# Altium schematic sheet 3DSensor, Magnet.SchDoc
size Letter; Organization: Cegep Limoilou; Address1: 1300, 8e Avenue; Address2: Québec, QC; Address3: Canada; Address4: G1J 5L5; Revision: Enseignants; SheetNumber: 4; SheetTotal: 8; Conception: Ilyes Gharmoul; Titre: 3D sensor and Magnet sensor; Modification: Ilyes G
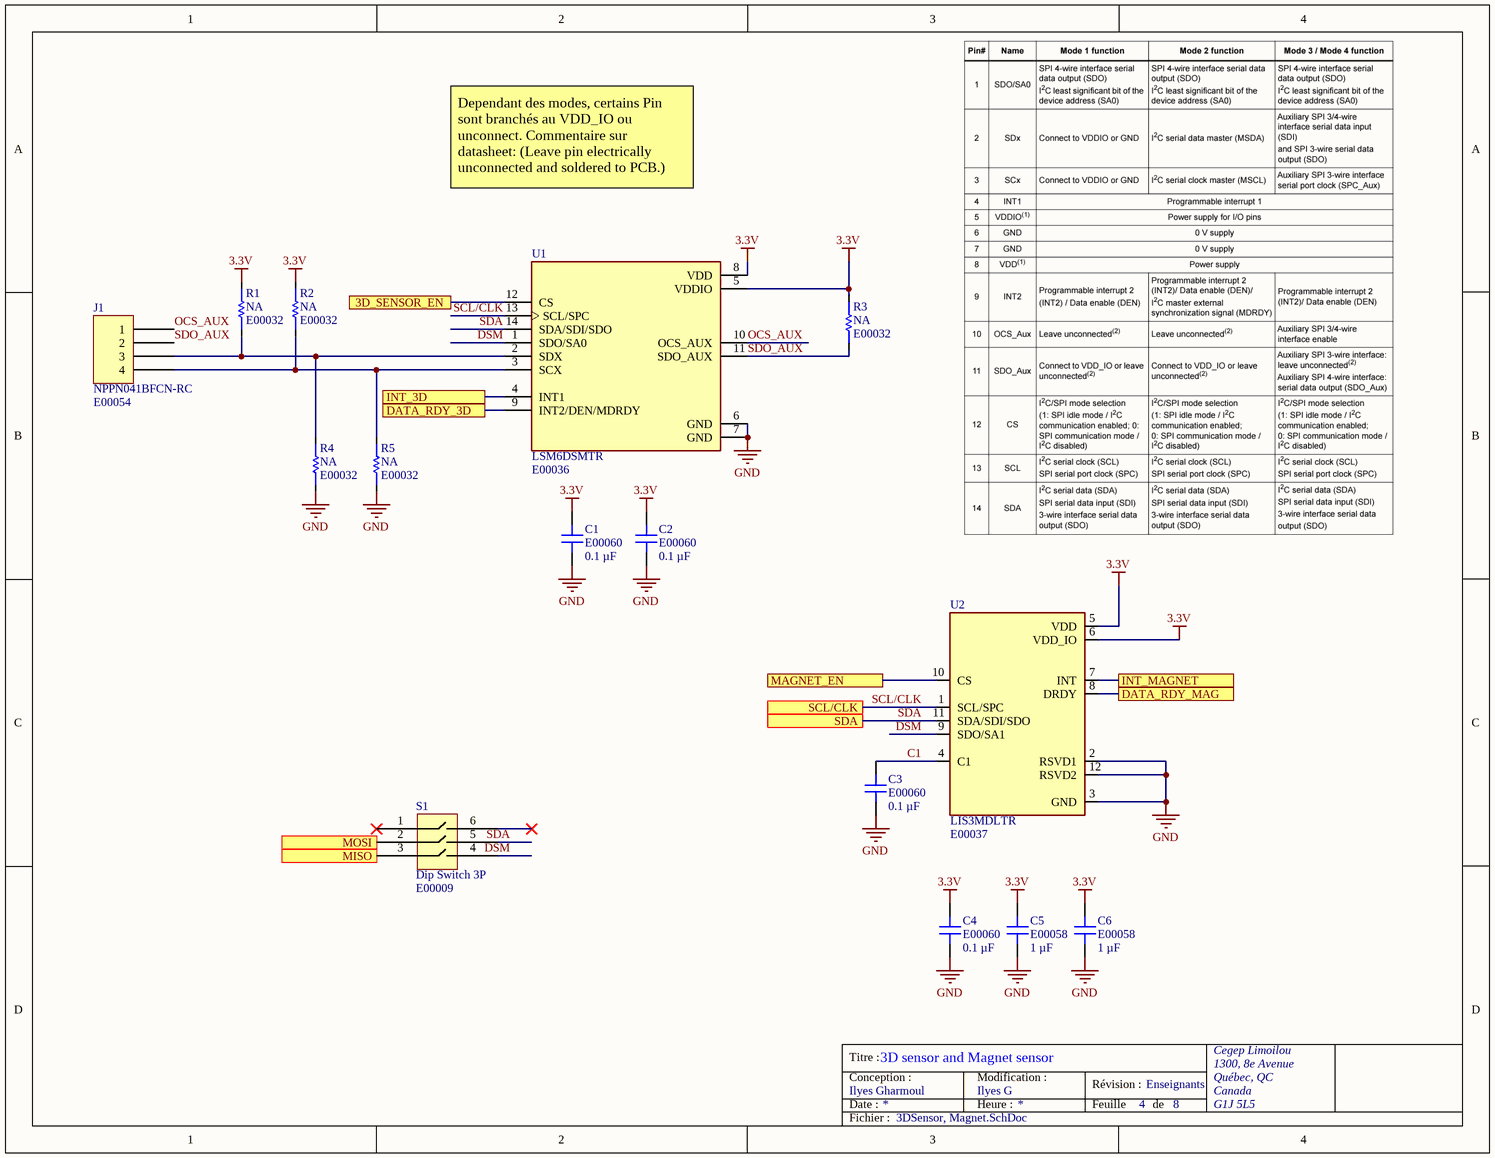
[diagram p0: 3DSensor, Magnet.SchDoc]

## Parts
C1  ADAM Inventory Number 1: E00060  [CAP 0603]  (hidden comment: 0.1 µF)
C2  ADAM Inventory Number 1: E00060  [CAP 0603]  (hidden comment: 0.1 µF)
C3  ADAM Inventory Number 1: E00060  [CAP 0603]  (hidden comment: 0.1 µF)
C4  ADAM Inventory Number 1: E00060  [CAP 0603]  (hidden comment: 0.1 µF)
C5  ADAM Inventory Number 1: E00058  [CAP 0603]  (hidden comment: 1 µF)
C6  ADAM Inventory Number 1: E00058  [CAP 0603]  (hidden comment: 1 µF)
J1  NPPN041BFCN-RC  ADAM Inventory Number 1: E00054  [CONN FEM HEADER 4PIN]
R1  NA  ADAM Inventory Number 1: E00032  [RES 0603]
R2  NA  ADAM Inventory Number 1: E00032  [RES 0603]
R3  NA  ADAM Inventory Number 1: E00032  [RES 0603]
R4  NA  ADAM Inventory Number 1: E00032  [RES 0603]
R5  NA  ADAM Inventory Number 1: E00032  [RES 0603]
S1  Dip Switch 3P  ADAM Inventory Number 1: E00009  [DIPSWITCH SMD 3P]
U1  LSM6DSMTR  ADAM Inventory Number 1: E00036  [PQFN50P300X250X86-14N]
U2  LIS3MDLTR  ADAM Inventory Number 1: E00037  [XDCR_LIS3MDLTR]

## Ports
3D_SENSOR_EN, DATA_RDY_3D, DATA_RDY_MAG, INT_3D, INT_MAGNET, MAGNET_EN, MISO, MOSI, SCL/CLK, SDA

## Nets
3.3V: C1.2 C2.2 C4.2 C5.2 C6.2 R1.2 R2.2 R3.2 U1.5(VDDIO) U1.8(VDD) U2.5(VDD) U2.6(VDD_IO)
GND: C1.1 C2.1 C3.1 C4.1 C5.1 C6.1 R4.1 R5.1 U1.6(GND) U1.7(GND) U2.2(RSVD1) U2.3(GND) U2.12(RSVD2)
3D_SENSOR_EN: U1.12(CS) ; port 3D_SENSOR_EN
C1: C3.2 U2.4(C1)
DATA_RDY_3D: U1.9(INT2/DEN/MDRDY) ; port DATA_RDY_3D
DATA_RDY_MAG: U2.8(DRDY) ; port DATA_RDY_MAG
DSM: S1.4 U1.1(SDO/SA0) U2.9(SDO/SA1)
INT_3D: U1.4(INT1) ; port INT_3D
INT_MAGNET: U2.7(INT) ; port INT_MAGNET
MAGNET_EN: U2.10(CS) ; port MAGNET_EN
MISO: S1.3 ; port MISO
MOSI: S1.2 ; port MOSI
OCS_AUX: J1.1 U1.10(OCS_AUX)
SCL/CLK: U1.13(SCL/SPC) U2.1(SCL/SPC) ; port SCL/CLK
SDA: S1.5 U1.14(SDA/SDI/SDO) U2.11(SDA/SDI/SDO) ; port SDA
SDO_AUX: J1.2 R3.1 U1.11(SDO_AUX)
NetJ1_3: J1.3 R1.1 R4.2 U1.2(SDX)
NetJ1_4: J1.4 R2.1 R5.2 U1.3(SCX)

Not connected (* = marked no-connect by the designer): S1 1* 6*

## Notes on the sheet
- Dependant des modes, certains Pin sont branchés au VDD_IO ou unconnect. Commentaire sur datasheet: (Leave pin electrically unconnected and soldered to PCB.)
- Titre :
- Conception :
- Date :
- Modification :
- Heure :
- Révision :
- Feuille
- de
- Fichier :

## Library data of the parts
C1-C4 = CAP CER 0.1UF 50V X7R 0603: Manufacturer Part Number 1: C0603C104K5RAC7411; manufacturer: KEMET; Tolerance: ±10%; Applications: Bypass, Decoupling; Capacitance: 0.1 µF; componentlink1description: Datasheet; componentlink1url: https://api.kemet.com/component-edge/download/datasheet/C0603C104K5RAC7411.pdf; componentlink2description: DigiKey Link; componentlink2url: https://www.digikey.com/en/products/detail/kemet/C0603C104K5RAC7411/3317013; Device Package: 0603 (1608 Metric); lastupdated: 2023-03-28 19:09:05; Lifecycle Status: Active; Minimum Order: 1; Mounting Type: Surface Mount, MLCC; Operating Temperature: -55°C ~ 125°C; Package / Case: 0603 (1608 Metric); packaging: TapeAndReel; partid: 2233; Part Status: Active; price: 0.01; series: SMD Comm X7R; Size / Dimension: 0.063" L x 0.031" W (1.60mm x 0.80mm); Supplier 1: DigiKey; Supplier Part Number 1: 399-C0603C104K5RAC7411CT-ND; Temperature Coefficient: X7R; Thickness (Max): 0.035" (0.90mm); Voltage - Rated: 50V; Value: 0.1 µF
C5 C6 = CAP CER 1UF 16V X7R 0603: Manufacturer Part Number 1: C0603C105K4RACAUTO; manufacturer: KEMET; Tolerance: ±10%; Applications: Automotive, Bypass, Decoupling; Capacitance: 1 µF; componentlink1description: Datasheet; componentlink1url: https://api.kemet.com/component-edge/download/datasheet/C0603C105K4RACAUTO.pdf; componentlink2description: DigiKey Link; componentlink2url: https://www.digikey.com/en/products/detail/kemet/C0603C105K4RACAUTO/8635831; Device Package: 0603 (1608 Metric); lastupdated: 2023-03-30 19:09:16; Lifecycle Status: Active; Minimum Order: 0; Mounting Type: Surface Mount, MLCC; Operating Temperature: -55°C ~ 125°C; Package / Case: 0603 (1608 Metric); partid: 2179; Part Status: Active; price: 0; Ratings: AEC-Q200; series: SMD Auto X7R; Size / Dimension: 0.063" L x 0.031" W (1.60mm x 0.80mm); Supplier 1: DigiKey; Supplier Part Number 1: 399-17704-2-ND; Temperature Coefficient: X7R; Thickness (Max): 0.037" (0.95mm); Voltage - Rated: 16V; Value: 1 µF
J1 = CONN FEM HEADER 4POS: CONN HDR 4POS 0.079 GOLD; Manufacturer: Sullins Connector Solutions; Connector Type: Header; Contact Length - Post: 0.094" (2.40mm); Current Rating (Amps): 2A; Material Flammability Rating: UL94 V-0; Number of Positions: 4; Number of Positions Loaded: All; Pitch - Mating: 0.079" (2.00mm); Style: Board to Board; Manufacturer Part Number 1: NPPN041BFCN-RC; ComponentLink1Description: Datasheet; ComponentLink1URL: https://drawings-pdf.s3.amazonaws.com/10483.pdf; ComponentLink2Description: DigiKey Link; ComponentLink2URL: https://www.digikey.com/en/products/detail/sullins-connector-solutions/NPPN041BFCN-RC/804806; Contact Finish - Mating: Gold; Contact Finish - Post: Gold; Contact Finish Thickness - Mating: Flash; Contact Type: Female Socket; Fastening Type: Push-Pull; Insulation Color: Black; Insulation Height: 0.173" (4.40mm); LastUpdated: 2022-06-21 14:42:51; Lifecycle Status: Active; Minimum Order: 1; Mounting Type: Through Hole; Number of Rows: 1; Operating Temperature: -40°C ~ 105°C; Packaging: Tube; Part Status: Active; Price: 0.30; Series: -; Supplier 1: DigiKey; Supplier Part Number 1: S5751-04-ND; Termination: Solder
R1-R5 = NA Res 0603: No resistance, just in case; Manufacturer Part Number 1: RC0603JR-070RL; Value: NA; Supplier 1: Digi-Key; Supplier Part Number 1: 311-0.0GRCT-ND
S1 = Dip Switch 3P: Dip Switch SPST 3 Position Surface Mount Slide (Standard) Actuator 25mA 24VDC; Manufacturer Part Number 1: DS04-254-2-03BK-SMT; Manufacturer: CUI; Source: IC_Component.SchLib; Design Item ID: Switch SLIDE SPDT 3 pos; Component Type: Switches; Supplier 1: Mouser; Supplier Part Number 1: 653-A6S-3102-H
U1 = LSM6DSMTR: Accelerometer, Gyroscope, Temperature, 6 Axis Sensor I²C, SPI Output; Supplier 1: Digi-Key; Supplier Part Number 1: 497-16696-1-ND; Manufacturer Part Number 1: LSM6DSMTR
U2 = LIS3MDLTR: Magnetoresistive Sensor X, Y, Z Axis 12-LGA (2x2); Supplier 1: Digi-Key; Supplier Part Number 1: 497-13892-1-ND; Manufacturer Part Number 1: LIS3MDLTR